# EAGLE design car (EAGLE 7.2.0)
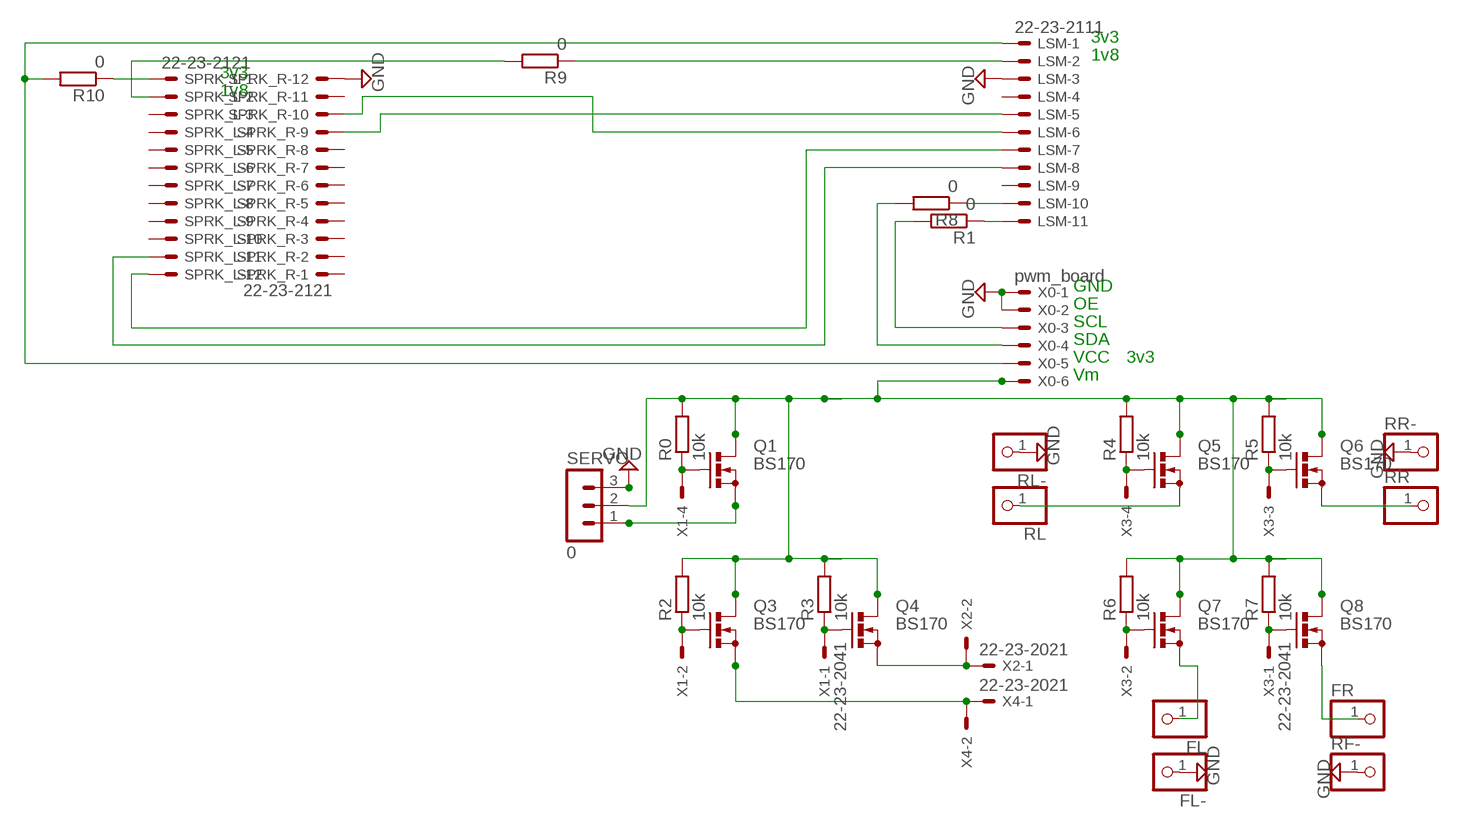
[diagram p0: schematic, sheet 1]

## Parts
FL  PINHD-1X1  [1X01]
FL-  PINHD-1X1  [1X01]
FR  PINHD-1X1  [1X01]
LSM  22-23-2111  [22-23-2111]
Q1  BS170  [SOT54E]
Q3  BS170  [SOT54E]
Q4  BS170  [SOT54E]
Q5  BS170  [SOT54E]
Q6  BS170  [SOT54E]
Q7  BS170  [SOT54E]
Q8  BS170  [SOT54E]
R0  10k  R-EU_0207/10  [0207/10]
R1  0  R-EU_0207/10  [0207/10]
R2  10k  R-EU_0207/10  [0207/10]
R3  10k  R-EU_0207/10  [0207/10]
R4  10k  R-EU_0207/10  [0207/10]
R5  10k  R-EU_0207/10  [0207/10]
R6  10k  R-EU_0207/10  [0207/10]
R7  10k  R-EU_0207/10  [0207/10]
R8  0  R-EU_0207/10  [0207/10]
R9  0  R-EU_0207/10  [0207/10]
R10  0  R-EU_0207/10  [0207/10]
RF-  PINHD-1X1  [1X01]
RL  PINHD-1X1  [1X01]
RL-  PINHD-1X1  [1X01]
RR  PINHD-1X1  [1X01]
RR-  PINHD-1X1  [1X01]
SERVO  0  MA03-1  [MA03-1]
SPRK_L  22-23-2121  [22-23-2121]
SPRK_R  22-23-2121  [22-23-2121]
X0  pwm_board  22-23-2061  [22-23-2061]
X1  22-23-2041  [22-23-2041]
X2  22-23-2021  [22-23-2021]
X3  22-23-2041  [22-23-2041]
X4  22-23-2021  [22-23-2021]

## Nets
1V8 [ground]: LSM.2 R9.1
FILL: LSM.10 R8.1
GND [ground]: FL-.1 LSM.3 RF-.1 RL-.1 RR-.1 SERVO.3 SPRK_R.12 X0.1 X0.2
N$1: Q1.G R0.1 X1.4
N$2: Q4.S X2.1 X2.2
N$3: Q3.G R2.1 X1.2
N$4: Q4.G R3.1 X1.1
N$5: Q1.S SERVO.1
N$6: Q5.S RL.1
N$7: Q6.S RR.1
N$8: Q3.S X4.1 X4.2
N$9: FR.1 Q8.S
N$10: Q5.G R4.1 X3.4
N$11: Q6.G R5.1 X3.3
N$12: Q7.G R6.1 X3.2
N$13: Q8.G R7.1 X3.1
N$14: FL.1 Q7.S
N$15: LSM.11 R1.1
N$17 [ground]: R9.2 SPRK_L.2
N$18: R8.2 X0.4
N$19: R1.2 X0.3
N$20: LSM.8 SPRK_L.11
N$21: LSM.7 SPRK_L.12
N$22 [ground]: R10.1 SPRK_L.1
N$23: LSM.5 SPRK_R.9
N$24: LSM.6 SPRK_R.10
V3V3 [ground]: LSM.1 R10.2 X0.5
VM: Q1.D Q3.D Q4.D Q5.D Q6.D Q7.D Q8.D R0.2 R2.2 R3.2 R4.2 R5.2 R6.2 R7.2 SERVO.2 X0.6
Unconnected: LSM.4 LSM.9 SPRK_L.3 SPRK_L.4 SPRK_L.5 SPRK_L.6 SPRK_L.7 SPRK_L.8 SPRK_L.9 SPRK_L.10 SPRK_R.1 SPRK_R.2 SPRK_R.3 SPRK_R.4 SPRK_R.5 SPRK_R.6 SPRK_R.7 SPRK_R.8 SPRK_R.11 X1.3

## Notes on the sheet
- 3v3
- 1v8
- 3v3
- 1v8
- GND
- OE
- SCL
- SDA
- VCC | 3v3
- Vm

## Library data of the parts
FL FL- FR RF- RL RL- RR RR- = pinhead:PINHD-1X1: PIN HEADER
LSM = con-molex:22-23-2111: .100" (2.54mm) Center Header - 11 Pin; MF: MOLEX; MPN: 22-23-2111; OC_FARNELL: 5388879; OC_NEWARK: 27C9916
Q1 Q3-Q8 = transistor-small-signal:BS170: N-CHANNEL MOS FET
R0 R1-R10 = rcl:R-EU_: RESISTOR, European symbol
SERVO = con-lstb:MA03-1: PIN HEADER; OC_FARNELL: unknown; OC_NEWARK: unknown
SPRK_L SPRK_R = con-molex:22-23-2121: .100" (2.54mm) Center Header - 12 Pin; MF: MOLEX; MPN: 22-23-2121; OC_FARNELL: 1462935; OC_NEWARK: 56H0456
X0 = con-molex:22-23-2061: .100" (2.54mm) Center Header - 6 Pin; MF: MOLEX; MPN: 22-23-2061; OC_FARNELL: 1462922; OC_NEWARK: 27C1933
X1 X3 = con-molex:22-23-2041: .100" (2.54mm) Center Header - 4 Pin; MF: MOLEX; MPN: 22-23-2041; OC_FARNELL: 1462920; OC_NEWARK: 38C0355
X2 X4 = con-molex:22-23-2021: .100" (2.54mm) Center Header - 2 Pin; MF: MOLEX; MPN: 22-23-2021; OC_FARNELL: 1462926; OC_NEWARK: 25C3832

## Net classes
0 default: width 0.508 mm, clearance 0.406 mm
1 ground: width 0.508 mm, clearance 0.406 mm

## Board
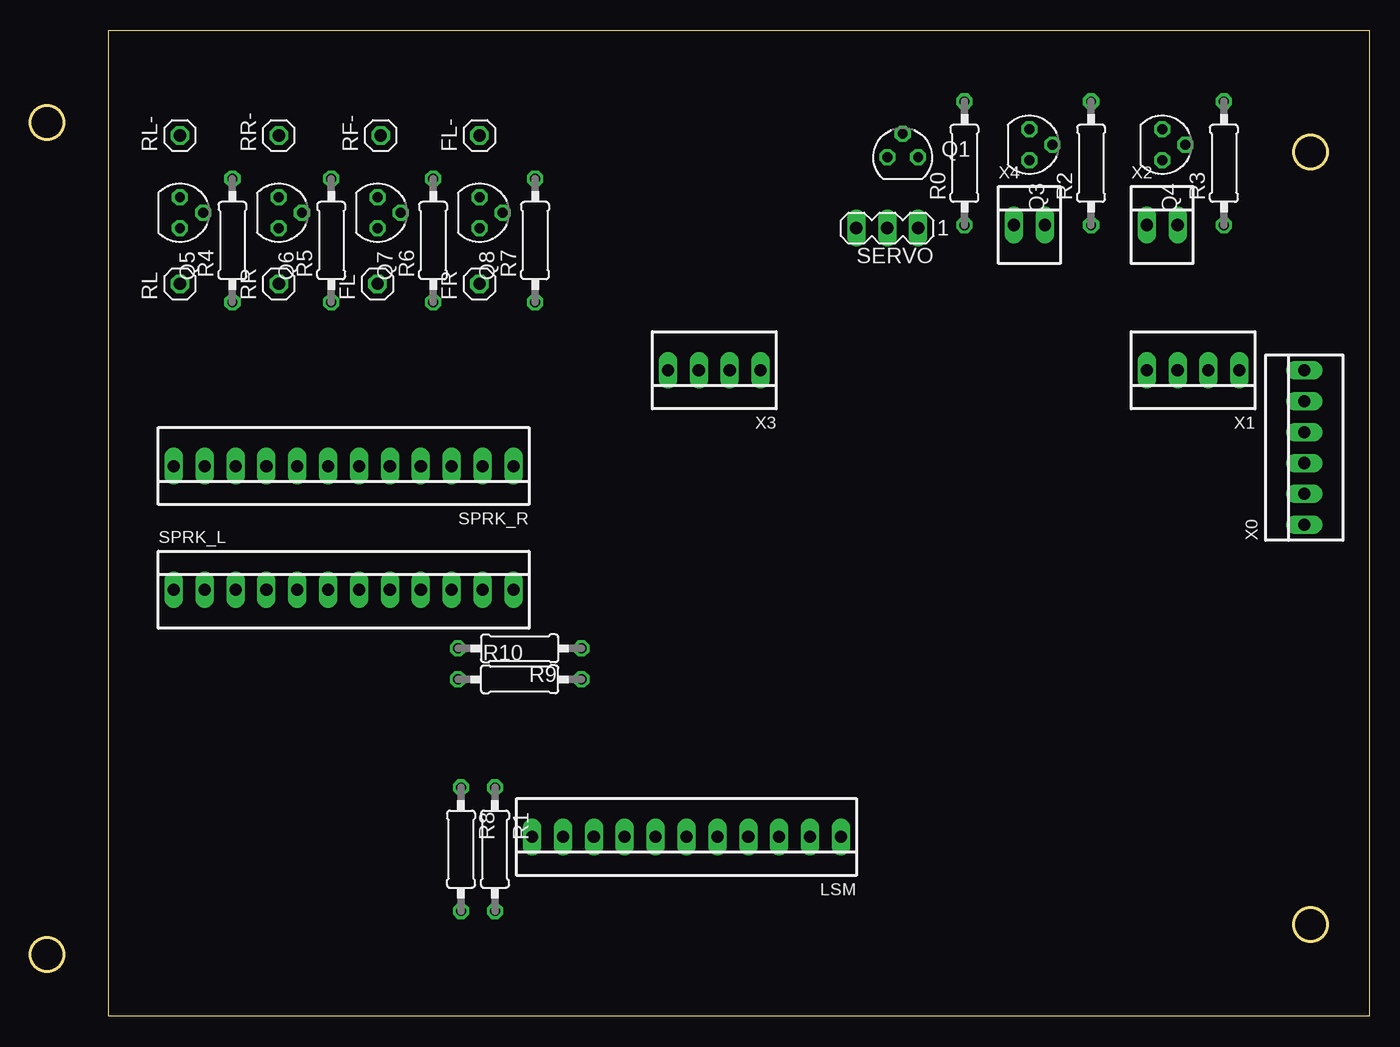
[diagram p1: board, top side]
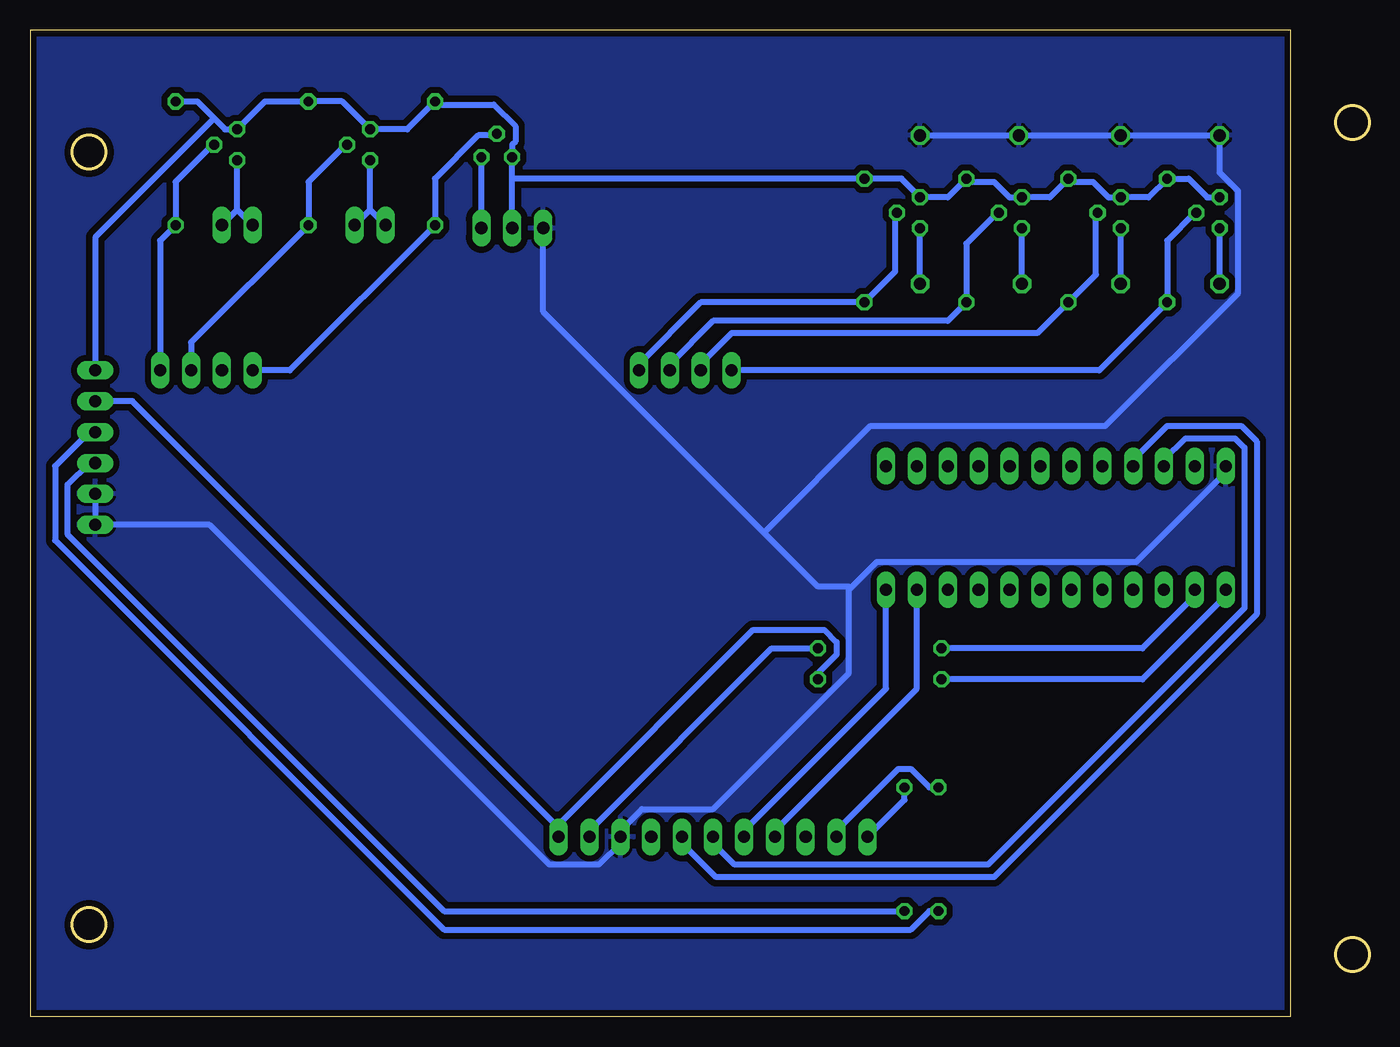
[diagram p2: board, bottom side, seen from below]

Size 110.08 x 81.03 mm. Coordinates in mm from the lower left corner, seen from the top.
Outline: 110.08,0 6.45,0 6.45,81.03 110.08,81.03 110.08,0
Outline: circle at 1.37,5.08 radius 1.37
Outline: circle at 1.37,73.46 radius 1.37
Outline: circle at 105.26,71.02 radius 1.37
Outline: circle at 105.26,7.52 radius 1.37
Copper layers (1*16): Top 0.035mm / dielectric 1.5mm / Bottom 0.035mm
Design rules "default *": minimum track width 20mil, minimum drill 24mil, track to track 20mil, track to pad 20mil, pad to pad 20mil, via to via 20mil, smd to smd 10mil, copper to edge 20mil, drill to drill 8mil, minimum pad ring 10mil, minimum via ring 8mil, stop-mask expansion 4mil, vias tented up to drill 0mil, thermal gap 10mil

### Footprints (pad centres in the part's own frame; a part is rotated, then mirrored left to right if it is on the bottom)
1X01 = drill 1.016 octagon: 1 0,0
22-23-2111 = drill 1 long: 1 -12.7,0; 2 -10.16,0; 3 -7.62,0; 4 -5.08,0; 5 -2.54,0; 6 0,0; 7 2.54,0; 8 5.08,0; 9 7.62,0; 10 10.16,0; 11 12.7,0
SOT54E = drill 0.813 octagon: D -1.27,0; G 0,1.905; S 1.27,0
0207/10 = drill 0.813 octagon: 1 -5.08,0; 2 5.08,0
MA03-1 = drill 1.016 long: 1 -2.54,0; 2 0,0; 3 2.54,0
22-23-2121 = drill 1 long: 1 -13.97,0; 2 -11.43,0; 3 -8.89,0; 4 -6.35,0; 5 -3.81,0; 6 -1.27,0; 7 1.27,0; 8 3.81,0; 9 6.35,0; 10 8.89,0; 11 11.43,0; 12 13.97,0
22-23-2061 = drill 1 long: 1 -6.35,0; 2 -3.81,0; 3 -1.27,0; 4 1.27,0; 5 3.81,0; 6 6.35,0
22-23-2041 = drill 1 long: 1 -3.81,0; 2 -1.27,0; 3 1.27,0; 4 3.81,0
22-23-2021 = drill 1 long: 1 -1.27,0; 2 1.27,0

### Placement (x,y rotation side)
FL  28.55,60.2 90 top
FL-  36.93,72.39 90 top
FR  36.93,60.2 90 top
LSM  53.95,14.73 180 top
Q1  71.73,70.61 0 top
Q3  82.14,71.63 270 top
Q4  93.07,71.63 270 top
Q5  12.29,66.04 270 top
Q6  20.42,66.04 270 top
Q7  28.55,66.04 270 top
Q8  36.93,66.04 270 top
R0  76.81,70.1 90 top
R1  38.2,13.72 270 top
R2  87.22,70.1 90 top
R3  98.15,70.1 90 top
R4  16.61,63.75 90 top
R5  24.74,63.75 90 top
R6  33.12,63.75 90 top
R7  41.5,63.75 90 top
R8  35.41,13.72 270 top
R9  40.23,30.23 180 top
R10  40.23,27.69 0 top
RF-  28.8,72.39 90 top
RL  12.29,60.2 90 top
RL-  12.29,72.39 90 top
RR  20.42,60.2 90 top
RR-  20.42,72.39 90 top
SERVO  70.46,64.77 180 top
SPRK_L  25.76,35.05 0 top
SPRK_R  25.76,45.21 180 top
X0  104.75,46.74 90 top
X1  95.61,53.09 180 top
X2  93.07,65.02 0 top
X3  56.24,53.09 180 top
X4  82.14,65.02 0 top

### Tracks (layer width: path | path; a pad name or v marks a point on that pad's centre or on a via)
1V8
  Bottom 0.508: R9.1 49.12,30.23 64.11,15.24 LSM.2
FILL
  Bottom 0.508: R8.1 36.17,18.8 37.69,20.32 38.71,20.32 43.79,15.24 LSM.10
GND
  Bottom 0.508: X0.2 X0.1 95.35,40.39 67.41,12.45 63.35,12.45 61.57,14.22 LSM.3 61.57,15.24 59.79,17.02 53.95,17.02 42.77,28.19 42.77,35.05 42.65,35.18 | FL-.1 RF-.1 RR-.1 RL-.1 12.29,69.34 10.77,67.82 10.77,59.44 21.69,48.51 41,48.51 49.76,39.75 | SPRK_R.12 11.79,44.7 19.15,37.34 40.49,37.34 42.65,35.18 | SERVO.3 67.92,57.91 49.76,39.75 | 49.76,39.75 45.31,35.31 42.77,35.31 42.65,35.18
  pour Bottom: 6.96,0.51 109.58,0.51 109.58,80.52 6.96,80.52
N$1
  Bottom 0.508: Q1.G 71.73,72.39 73.25,72.39 76.81,68.83 R0.1 88.75,53.09 X1.4
N$2
  Bottom 0.508: 93.07,66.29 Q4.S | X2.1 93.07,66.29 | 93.07,66.29 X2.2
N$3
  Bottom 0.508: Q3.G 84.18,71.63 87.22,68.58 R2.1 96.88,55.37 X1.2
N$4
  Bottom 0.508: Q4.G 95.1,71.63 98.15,68.58 R3.1 99.42,63.75 X1.1
N$5
  Bottom 0.508: SERVO.1 Q1.S
N$6
  Bottom 0.508: RL.1 Q5.S
N$7
  Bottom 0.508: RR.1 Q6.S
N$8
  Bottom 0.508: 82.14,66.29 Q3.S | X4.1 82.14,66.29 | 82.14,66.29 X4.2
N$9
  Bottom 0.508: FR.1 Q8.S
N$10
  Bottom 0.508: Q5.G 14.33,66.04 16.61,63.75 R4.1 22.2,53.09 X3.4
N$11
  Bottom 0.508: Q6.G 22.45,66.04 22.45,60.96 R5.1 27.28,56.13 52.43,56.13 54.97,53.59 X3.3
N$12
  Bottom 0.508: Q7.G 30.58,66.04 33.12,63.5 R6.1 34.65,57.15 53.95,57.15 57.51,53.59 X3.2
N$13
  Bottom 0.508: Q8.G 38.96,66.04 38.96,61.21 R7.1 54.97,58.67 60.05,53.59 X3.1
N$14
  Bottom 0.508: FL.1 Q7.S
N$15
  Bottom 0.508: R1.1 38.2,17.78 LSM.11
N$17
  Bottom 0.508: R9.2 18.64,30.23 14.33,34.54 SPRK_L.2
N$18
  Bottom 0.508: R8.2 36.17,8.64 37.69,7.11 76.05,7.11 108.05,39.12 108.05,45.21 105.26,48.01 X0.4
N$19
  Bottom 0.508: R1.2 76.05,8.64 107.04,39.62 107.04,43.69 105.26,45.47 X0.3
N$20
  Bottom 0.508: SPRK_L.11 37.19,26.92 48.87,15.24 LSM.8
N$21
  Bottom 0.508: SPRK_L.12 39.73,26.92 51.41,15.24 LSM.7
N$22
  Bottom 0.508: R10.1 18.64,27.69 11.79,34.54 SPRK_L.1
N$23
  Bottom 0.508: LSM.5 56.49,14.22 53.7,11.43 30.84,11.43 9.25,33.02 9.25,47.24 10.52,48.51 16.61,48.51 19.41,45.72 SPRK_R.9
N$24
  Bottom 0.508: LSM.6 53.95,14.22 52.17,12.45 31.34,12.45 10.26,33.53 10.26,46.74 11.02,47.5 15.09,47.5 16.87,45.72 SPRK_R.10
V3V3
  Bottom 0.508: X0.5 101.7,50.55 66.65,15.49 LSM.1 66.65,15.75 50.65,31.75 44.81,31.75 43.79,30.73 43.79,29.72 45.31,28.19 R10.2
VM
  Bottom 0.508: Q5.D 13.31,67.31 14.83,68.83 R4.2 18.14,67.31 Q6.D 21.44,67.31 22.71,68.58 24.74,68.58 R5.2 26.26,67.31 Q7.D 29.57,67.31 30.84,68.58 33.12,68.58 R6.2 34.65,67.31 Q8.D 38.46,68.83 R7.2 70.46,68.83 | SERVO.2 70.46,68.83 | 70.46,68.83 Q1.D 70.46,71.63 70.21,71.88 70.21,73.15 71.98,74.93 76.81,74.93 R0.2 79.1,72.9 Q3.D 84.43,75.18 R2.2 90.78,75.18 Q4.D 94.08,72.9 94.97,73.79 | 94.97,73.79 96.37,75.18 R3.2 | X0.6 104.75,64.01 94.97,73.79